# Altium project Board.PrjPCB
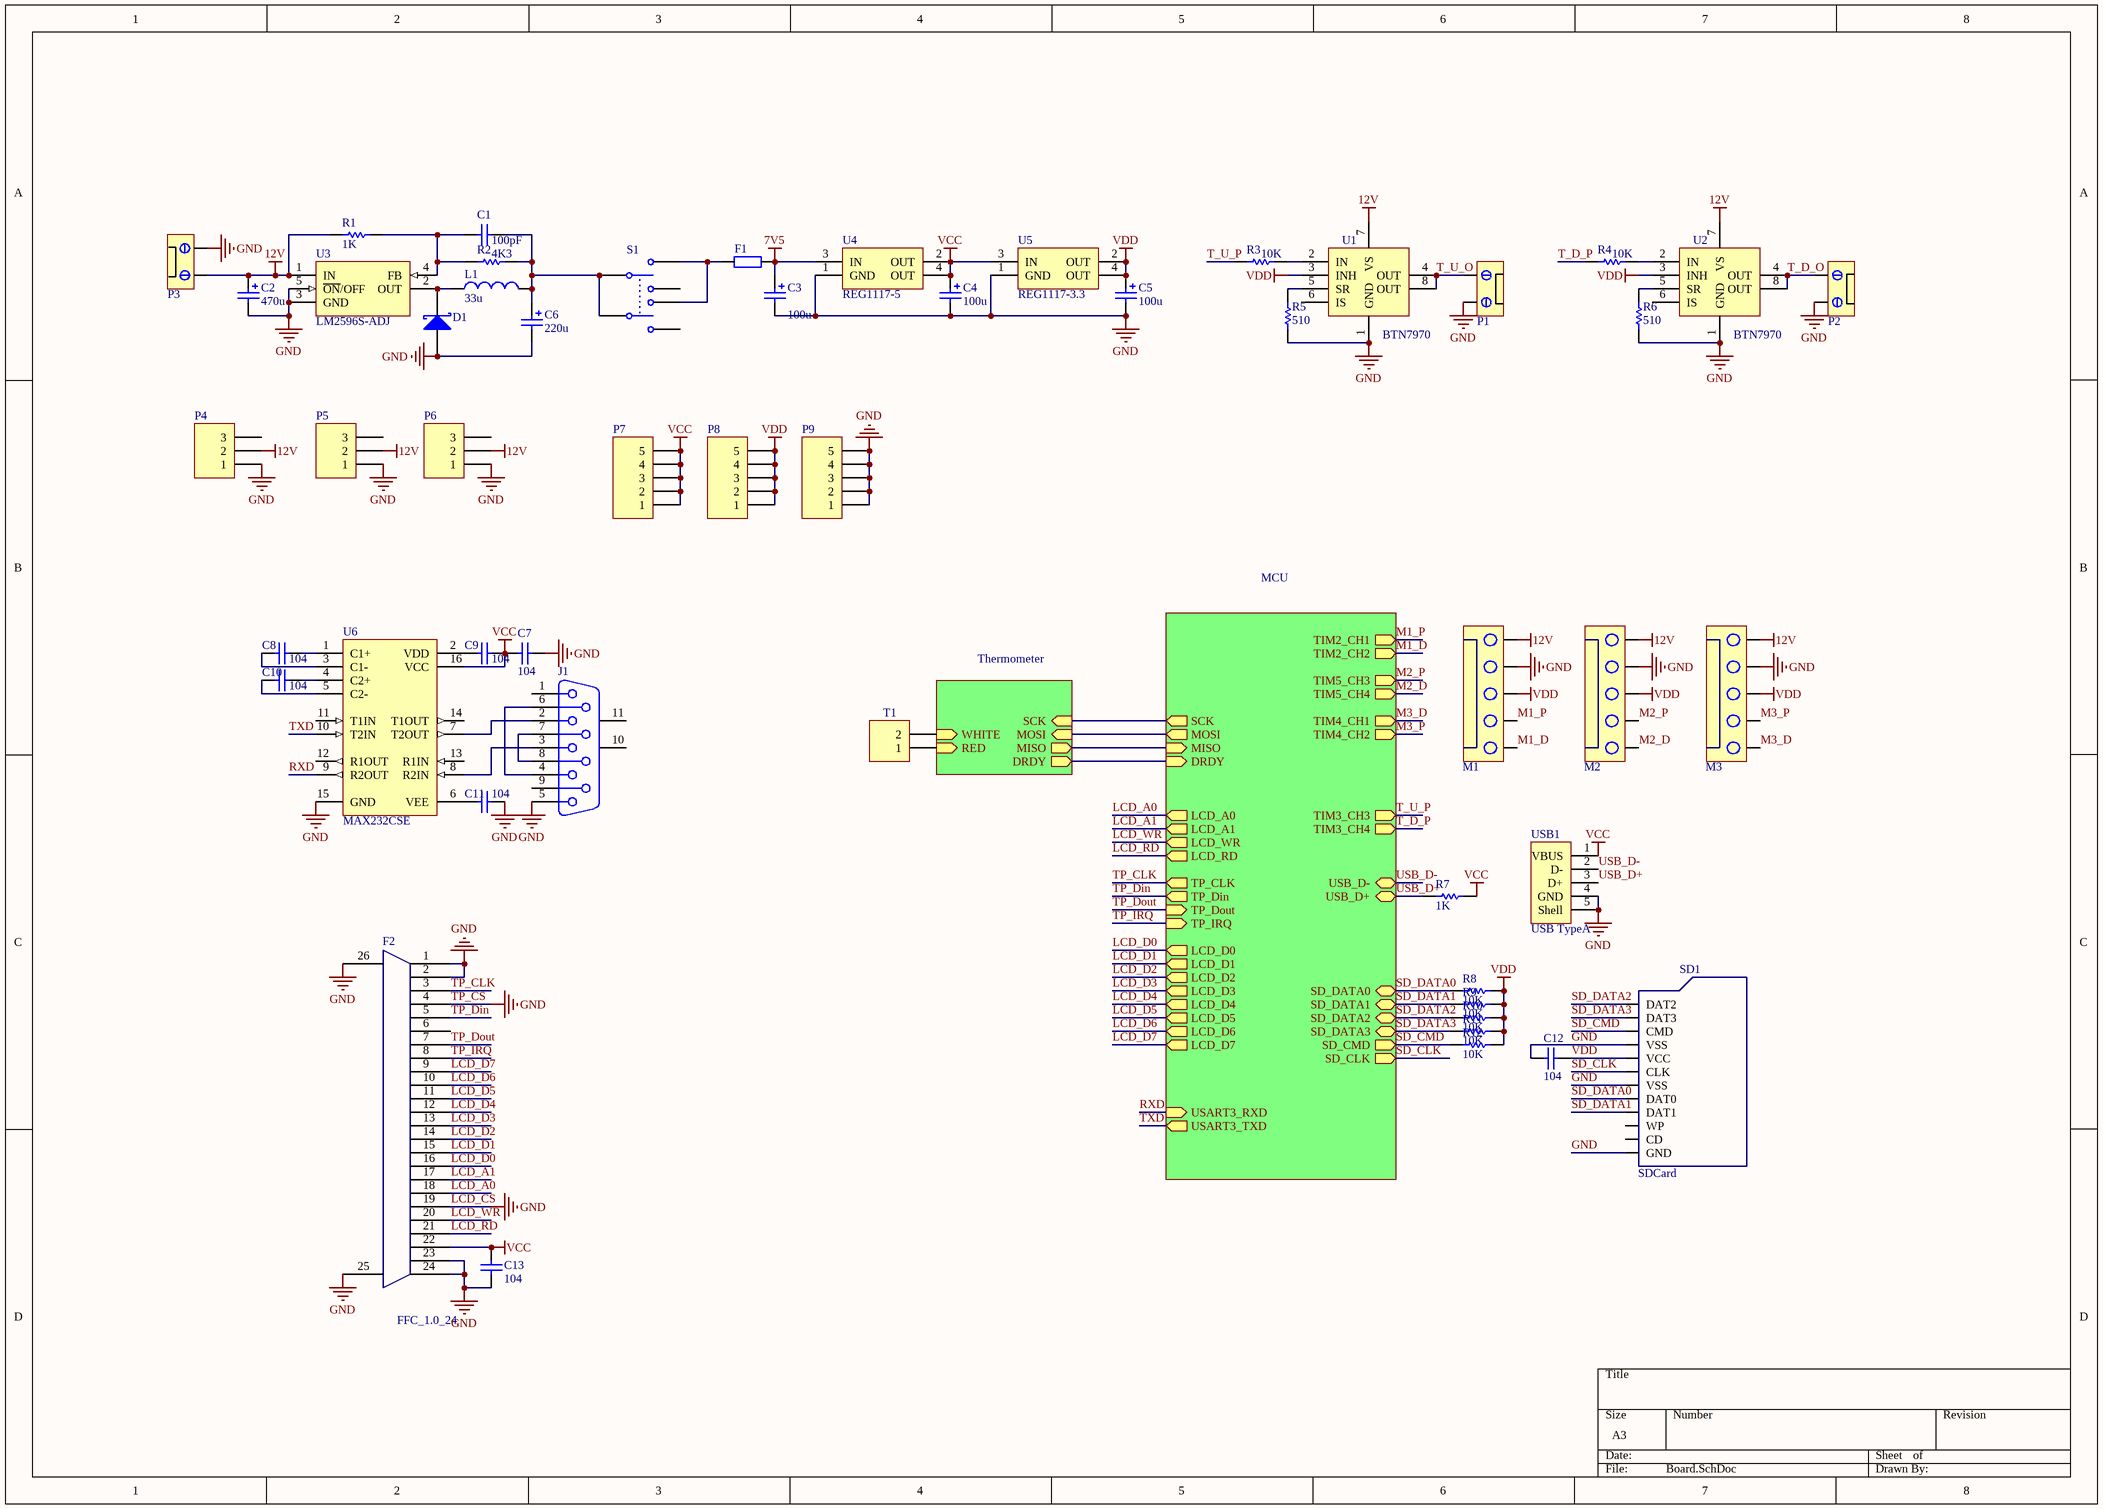
[diagram p0: Board.SchDoc]
3 sheets, 112 parts. Net scope: hierarchical (ports join the sheet entries above them; power ports are global).
Board file: board.PcbDoc
Sheets:
  Board.SchDoc
    Designator = Thermometer.SchDoc
    Designator = MCU.SchDoc

## Sheet Board.SchDoc
size A3

### Parts
C1  value 100pF  [CR2012-0805]  (hidden comment: Cap)
C2  value 470u  [CAP POL Surface MOUNT-10]  (hidden comment: Cap Pol3)
C3  value 100u  [CAP POL Surface Mount-6.3]  (hidden comment: Cap Pol3)
C4  value 100u  [CAP POL Surface Mount-6.3]  (hidden comment: Cap Pol3)
C5  value 100u  [CAP POL Surface Mount-6.3]  (hidden comment: Cap Pol3)
C6  value 220u  [CAP POL Surface Mount-6.3]  (hidden comment: Cap Pol3)
C7  value 104  [CR2012-0805]  (hidden comment: Cap)
C8  value 104  [CR2012-0805]  (hidden comment: Cap)
C9  value 104  [CR2012-0805]  (hidden comment: Cap)
C10  value 104  [CR2012-0805]  (hidden comment: Cap)
C11  value 104  [CR2012-0805]  (hidden comment: Cap)
C12  value 104  [CR2012-0805]  (hidden comment: Cap)
C13  value 104  [CR2012-0805]  (hidden comment: Cap)
D1  D Schottky  [DSO-C2/X2.3]  (value not drawn)
F1  FB  [CR2012-0805]  (value not drawn)
F2  FFC_1.0_24  [FFC/SM1.0-2H24]
J1  D Connector 9  [DSUB1.385-2H9]  (value not drawn)
L1  value 33u  [inductor]  (hidden comment: Inductor)
M1  ConnP_5  [Conn_5-5.08]  (value not drawn)
M2  ConnP_5  [Conn_5-5.08]  (value not drawn)
M3  ConnP_5  [Conn_5-5.08]  (value not drawn)
P1  ConnP_2  [Conn_2-5.08]  (value not drawn)
P2  ConnP_2  [Conn_2-5.08]  (value not drawn)
P3  ConnP_2  [Conn_2-5.08]  (value not drawn)
P4  Header 3  [HDR1X3]  (value not drawn)
P5  Header 3  [HDR1X3]  (value not drawn)
P6  Header 3  [HDR1X3]  (value not drawn)
P7  Header 5  [HDR1X5]  (value not drawn)
P8  Header 5  [HDR1X5]  (value not drawn)
P9  Header 5  [HDR1X5]  (value not drawn)
R1  value 1K  [CR2012-0805]  (hidden comment: Res)
R2  value 4K3  [CR2012-0805]  (hidden comment: Res)
R3  value 10K  [CR2012-0805]  (hidden comment: Res)
R4  value 10K  [CR2012-0805]  (hidden comment: Res)
R5  value 510  [CR2012-0805]  (hidden comment: Res)
R6  value 510  [CR2012-0805]  (hidden comment: Res)
R7  value 1K  [CR2012-0805]  (hidden comment: Res)
R8  value 10K  [CR2012-0805]  (hidden comment: Res)
R9  value 10K  [CR2012-0805]  (hidden comment: Res)
R10  value 10K  [CR2012-0805]  (hidden comment: Res)
R11  value 10K  [CR2012-0805]  (hidden comment: Res)
R12  value 10K  [CR2012-0805]  (hidden comment: Res)
S1  SW-DPDT  [DPDT-6]  (value not drawn)
SD1  SDCard  [SDCARD]
T1  Header 2  [HDR1X2]  (value not drawn)
U1  BTN7970  [TS7B]
U2  BTN7970  [TS7B]
U3  LM2596S-ADJ  [TS5B]
U4  REG1117-5  [ZZ311]
U5  REG1117-3.3  [ZZ311]
U6  MAX232CSE  [NSO16]
USB1  USB TypeA  [USB_A]

### Sub-sheets
Designator = Thermometer: SCK (in), MOSI (in), MISO (out), DRDY (out), WHITE (in), RED (in)
Designator = MCU: USART3_RXD (in), USART3_TXD (out), SCK (out), MOSI (out), MISO (in), DRDY (in), LCD_A0 (out), LCD_A1 (out), LCD_WR (out), LCD_RD (out), TP_CLK (out), TP_Din (out), TP_Dout (in), TP_IRQ (in), LCD_D0 (out), LCD_D1 (out), LCD_D2 (out), LCD_D3 (out), LCD_D4 (out), LCD_D5 (out), LCD_D6 (out), LCD_D7 (out), TIM2_CH1 (out), TIM2_CH2 (out), TIM5_CH3 (out), TIM5_CH4 (out), TIM3_CH3 (out), TIM3_CH4 (out), TIM4_CH1 (out), TIM4_CH2 (out), SD_DATA3 (bidir), SD_DATA0 (bidir), SD_DATA1 (bidir), SD_DATA2 (bidir), SD_CMD (out), SD_CLK (out), USB_D+ (bidir), USB_D- (bidir)

### Nets
7V5: C3.1 F1.2 U4.3(IN)
12V: C2.1 M1.5 M2.5 M3.5 P3.1 P4.2 P5.2 P6.2 R1.1 U1.7(VS) U2.7(VS) U3.1(IN)
GND: C2.2 C3.2 C4.2 C5.2 C6.2 C7.1 C11.1 C12.1 C13.1 D1.1(A) F2.1 F2.2 F2.4 F2.19 F2.23 F2.24 F2.25 F2.26 J1.5 M1.4 M2.4 M3.4 P1.2 P2.2 P3.2 P4.1 P5.1 P6.1 P9.1 P9.2 P9.3 P9.4 P9.5 R5.1 R6.1 SD1.0(GND) SD1.3(VSS) SD1.6(VSS) U1.1(GND) U2.1(GND) U3.3(GND) U3.5(~{ON}/OFF) U4.1(GND) U5.1(GND) U6.15(GND) USB1.4(GND) USB1.5(Shell)  [also labelled LCD_CS, TP_CS]
VCC: C4.1 C7.2 C9.1 C13.2 F2.22 P7.1 P7.2 P7.3 P7.4 P7.5 R7.1 U4.2(OUT) U4.4(OUT) U5.3(IN) U6.16(VCC) USB1.1(VBUS)
VDD: C5.1 C12.2 M1.3 M2.3 M3.3 P8.1 P8.2 P8.3 P8.4 P8.5 R8.2 R9.2 R10.2 R11.2 R12.2 SD1.4(VCC) U1.3(INH) U2.3(INH) U5.2(OUT) U5.4(OUT)
DRDY: sheet Designator/DRDY, sheet Designator/DRDY
LCD_A0: F2.18 ; sheet Designator/LCD_A0
LCD_A1: F2.17 ; sheet Designator/LCD_A1
LCD_D0: F2.16 ; sheet Designator/LCD_D0
LCD_D1: F2.15 ; sheet Designator/LCD_D1
LCD_D2: F2.14 ; sheet Designator/LCD_D2
LCD_D3: F2.13 ; sheet Designator/LCD_D3
LCD_D4: F2.12 ; sheet Designator/LCD_D4
LCD_D5: F2.11 ; sheet Designator/LCD_D5
LCD_D6: F2.10 ; sheet Designator/LCD_D6
LCD_D7: F2.9 ; sheet Designator/LCD_D7
LCD_RD: F2.21 ; sheet Designator/LCD_RD
LCD_WR: F2.20 ; sheet Designator/LCD_WR
M1_D: M1.1 ; sheet Designator/TIM2_CH2
M1_P: M1.2 ; sheet Designator/TIM2_CH1
M2_D: M2.1 ; sheet Designator/TIM5_CH4
M2_P: M2.2 ; sheet Designator/TIM5_CH3
M3_D: M3.1 ; sheet Designator/TIM4_CH1
M3_P: M3.2 ; sheet Designator/TIM4_CH2
MISO: sheet Designator/MISO, sheet Designator/MISO
MOSI: sheet Designator/MOSI, sheet Designator/MOSI
PC13: sheet Designator/SCK, sheet Designator/SCK
RED: T1.1 ; sheet Designator/RED
RXD: U6.9(R2OUT) ; sheet Designator/USART3_RXD  [project net PB11]
SD_CLK: SD1.5(CLK) ; sheet Designator/SD_CLK  [project net PC12]
SD_CMD: R12.1 SD1.2(CMD) ; sheet Designator/SD_CMD  [project net PD2]
SD_DATA0: R8.1 SD1.7(DAT0) ; sheet Designator/SD_DATA0  [project net PC8]
SD_DATA1: R9.1 SD1.8(DAT1) ; sheet Designator/SD_DATA1  [project net PC9]
SD_DATA2: R10.1 SD1.9(DAT2) ; sheet Designator/SD_DATA2  [project net PC10]
SD_DATA3: R11.1 SD1.1(DAT3) ; sheet Designator/SD_DATA3  [project net PC11]
T_D_O: P2.1 U2.4(OUT) U2.8(OUT)
T_D_P: R4.1 ; sheet Designator/TIM3_CH4  [project net PB1]
T_U_O: P1.1 U1.4(OUT) U1.8(OUT)
T_U_P: R3.1 ; sheet Designator/TIM3_CH3  [project net PB0]
TP_CLK: F2.3 ; sheet Designator/TP_CLK  [project net PF10]
TP_Din: F2.5 ; sheet Designator/TP_Din  [project net PF9]
TP_Dout: F2.7 ; sheet Designator/TP_Dout  [project net PF8]
TP_IRQ: F2.8 ; sheet Designator/TP_IRQ  [project net PF7]
TXD: U6.10(T2IN) ; sheet Designator/USART3_TXD  [project net PB10]
USB_D+: R7.2 USB1.3(D+) ; sheet Designator/USB_D+
USB_D-: USB1.2(D-) ; sheet Designator/USB_D-
WHITE: T1.2 ; sheet Designator/WHITE
NetC1_1: C1.1 R1.2 R2.1 U3.4(FB)
NetC1_2: C1.2 C6.1 L1.2 R2.2 S1.2 S1.5
NetC8_1: C8.1 U6.1(C1+)
NetC8_2: C8.2 U6.3(C1-)
NetC9_2: C9.2 U6.2(VDD)
NetC10_1: C10.1 U6.4(C2+)
NetC10_2: C10.2 U6.5(C2-)
NetC11_2: C11.2 U6.6(VEE)
NetD1_2: D1.2(K) L1.1 U3.2(OUT)
NetF1_1: F1.1 S1.1 S1.6
NetJ1_2: J1.2 U6.7(T2OUT)
NetJ1_3: J1.3 U6.8(R2IN)
NetJ1_4: J1.4 J1.6
NetJ1_7: J1.7 J1.8
NetR3_2: R3.2 U1.2(IN)
NetR4_2: R4.2 U2.2(IN)
NetR5_2: R5.2 U1.5(SR)
NetR6_2: R6.2 U2.5(SR)

Not connected (* = marked no-connect by the designer): F2 6(5); J1 1 9 10(MH1) 11(MH2); P4 3; P5 3; P6 3; S1 3 4; SD1 10(WP) 11(CD); U1 6(IS); U2 6(IS); U6 11(T1IN) 12(R1OUT) 13(R1IN) 14(T1OUT)

### Library data of the parts
C1 C7-C13 = Cap: Capacitor; Published: 8-Jun-2000; LatestRevisionDate: 17-Jul-2002; LatestRevisionNote: Re-released for DXP Platform.; Publisher: Altium Limited
C2-C6 = Cap Pol3: Polarized Capacitor (Surface Mount); Published: 8-Jun-2000; LatestRevisionDate: 17-Jul-2002; LatestRevisionNote: Re-released for DXP Platform.; PackageReference: C0805; Publisher: Altium Limited
D1 = D Schottky: Schottky Diode; Published: 8-Jun-2000; LatestRevisionDate: 17-Jul-2002; LatestRevisionNote: Re-released for DXP Platform.; Publisher: Altium Limited; Code_JEDEC: DO-214-AA
F2 = FFC/SM1.0-2H24
J1 = D Connector 9: Receptacle Assembly, 9 Position, Right Angle; PackageDocument: O; Positions: 9; Published: 15-Jun-2001; LatestRevisionDate: 17-Jul-2002; LatestRevisionNote: Re-released for DXP Platform.; DatasheetDocument: 1-Sep-1999; PackageReference: 788750; Publisher: Altium Limited; Orientation: Right Angle; Gender: Receptacle
L1 = Inductor: Code_IEC: 1005; Published: 8-Jun-2000; LatestRevisionDate: 17-Jul-2002; LatestRevisionNote: Re-released for DXP Platform.; PackageReference: 0402-A; Publisher: Altium Limited; Code_JEITA: 0402
P4-P6 = Header 3: Header, 3-Pin; LatestRevisionDate: 17-Jul-2002; LatestRevisionNote: Re-released for DXP Platform.; Publisher: Altium Limited
P7-P9 = Header 5: Header, 5-Pin; LatestRevisionDate: 17-Jul-2002; LatestRevisionNote: Re-released for DXP Platform.; Publisher: Altium Limited
R1-R12 = Res: Resistor; Published: 8-Jun-2000; LatestRevisionDate: 17-Jul-2002; LatestRevisionNote: Re-released for DXP Platform.; Publisher: Altium Limited
S1 = SW-DPDT: Double-Pole, Double-Throw Switch; Published: 24-Mar-1999; LatestRevisionDate: 17-Jul-2002; LatestRevisionNote: Re-released for DXP Platform.; Publisher: Altium Limited
T1 = Header 2: Header, 2-Pin; LatestRevisionDate: 17-Jul-2002; LatestRevisionNote: Re-released for DXP Platform.; Publisher: Altium Limited
U3 = LM2596S-ADJ: Simple Switcher Power Converter 150 kHz 3A Step Down Voltage Regulator; Note: Tab is connected to GND; Published: 15-Apr-2002; DatasheetDocument: Dec-1997; PackageReference: TS5B; Publisher: Altium Limited
U4 = REG1117-5: 800mA and 1A Low Dropout Positive Regulator 2.85V, 3.3V, 5V, and Adjustable; PackageDocument: revC; Published: 8-Jun-2000; LatestRevisionDate: 17-Jul-2002; LatestRevisionNote: Re-released for DXP Platform.; DatasheetDocument: Sep-1997; PackageReference: ZZ311; Publisher: Altium Limited
U5 = REG1117-3.3: 800mA and 1A Low Dropout Positive Regulator 2.85V, 3.3V, 5V, and Adjustable; PackageDocument: revC; Published: 8-Jun-2000; LatestRevisionDate: 17-Jul-2002; LatestRevisionNote: Re-released for DXP Platform.; DatasheetDocument: Sep-1997; PackageReference: ZZ311; Publisher: Altium Limited
U6 = MAX232CSE: +5V Powered, Multi-Channel RS-232 Driver/Receiver; Published: 16-Jan-2001; LatestRevisionDate: 17-Jul-2002; LatestRevisionNote: Re-released for DXP Platform.; PackageReference: NSO16; Publisher: Altium Limited; Code_JEDEC: MS-012-AC; Code_IPC: SO16
USB1 = USB_A

## Sheet Thermometer.SchDoc
size A4
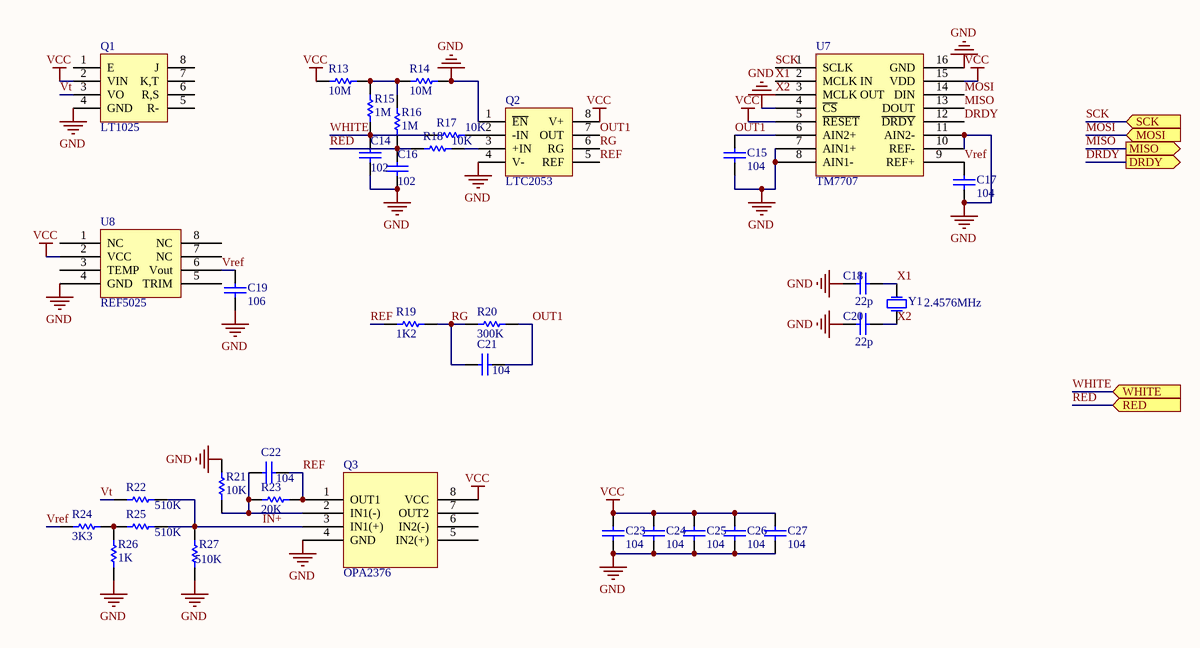
[diagram p1: Thermometer.SchDoc]

### Parts
C14  value 102  [CR2012-0805]  (hidden comment: Cap)
C15  value 104  [CR2012-0805]  (hidden comment: Cap)
C16  value 102  [CR2012-0805]  (hidden comment: Cap)
C17  value 104  [CR2012-0805]  (hidden comment: Cap)
C18  value 22p  [CR2012-0805]  (hidden comment: Cap)
C19  value 106  [CC3216-1206]  (hidden comment: Cap)
C20  value 22p  [CR2012-0805]  (hidden comment: Cap)
C21  value 104  [CR2012-0805]  (hidden comment: Cap)
C22  value 104  [CR2012-0805]  (hidden comment: Cap)
C23  value 104  [CR2012-0805]  (hidden comment: Cap)
C24  value 104  [CR2012-0805]  (hidden comment: Cap)
C25  value 104  [CR2012-0805]  (hidden comment: Cap)
C26  value 104  [CR2012-0805]  (hidden comment: Cap)
C27  value 104  [CR2012-0805]  (hidden comment: Cap)
Q1  LT1025  [SO-G8]
Q2  LTC2053  [MSOP-8]
Q3  OPA2376  [SO-G8]
R13  value 10M  [CR2012-0805]  (hidden comment: Res)
R14  value 10M  [CR2012-0805]  (hidden comment: Res)
R15  value 1M  [CR2012-0805]  (hidden comment: Res)
R16  value 1M  [CR2012-0805]  (hidden comment: Res)
R17  value 10K  [CR2012-0805]  (hidden comment: Res)
R18  value 10K  [CR2012-0805]  (hidden comment: Res)
R19  value 1K2  [CR2012-0805]  (hidden comment: Res)
R20  value 300K  [CR2012-0805]  (hidden comment: Res)
R21  value 10K  [CR2012-0805]  (hidden comment: Res)
R22  value 510K  [CR2012-0805]  (hidden comment: Res)
R23  value 20K  [CR2012-0805]  (hidden comment: Res)
R24  value 3K3  [CR2012-0805]  (hidden comment: Res)
R25  value 510K  [CR2012-0805]  (hidden comment: Res)
R26  value 1K  [CR2012-0805]  (hidden comment: Res)
R27  value 510K  [CR2012-0805]  (hidden comment: Res)
U7  TM7707  [SO-G16/D10]
U8  REF5025  [SO-G8]
Y1  Frequancy: 2.4576MHz  [XTAL]  (hidden comment: XTAL)

### Ports
DRDY (out), MISO (out), MOSI (in), RED (in), SCK (in), WHITE (in)

### Nets
GND: C14.1 C15.2 C16.1 C17.1 C18.1 C19.1 C20.1 C23.1 C24.1 C25.1 C26.1 C27.1 Q1.4(GND) Q2.1(~{EN}) Q2.4(V-) Q3.4(GND) R14.1 R21.2 R26.1 R27.1 U7.4(~{CS}) U7.7(AIN1+) U7.8(AIN1-) U7.10(REF-) U7.11(AIN2-) U7.16(GND) U8.4(GND)
VCC: C23.2 C24.2 C25.2 C26.2 C27.2 Q1.2(VIN) Q2.8(V+) Q3.8(VCC) R13.2 U7.5(~{RESET}) U7.15(VDD) U8.2(VCC)
DRDY: U7.12(~{DRDY}) ; port DRDY
IN+: Q3.3(IN1(+)) R22.2 R25.2 R27.2
MISO: U7.13(DOUT) ; port MISO
MOSI: U7.14(DIN) ; port MOSI
OUT1: C15.1 C21.1 Q2.7(OUT) R20.2 U7.6(AIN2+)
RED: C16.2 R16.1 R18.1 ; port RED
REF: C22.1 Q2.5(REF) Q3.1(OUT1) R19.1 R23.1
RG: C21.2 Q2.6(RG) R19.2 R20.1
SCK: U7.1(SCLK) ; port SCK  [project net PC13]
Vref: C17.2 C19.2 R24.1 U7.9(REF+) U8.6(Vout)
Vt: Q1.3(VO) R22.1
WHITE: C14.2 R15.1 R17.1 ; port WHITE
X1: C18.2 U7.2(MCLK_IN) Y1.2(OSC2)
X2: C20.2 U7.3(MCLK_OUT) Y1.1(OSC1)
NetC22_2: C22.2 Q3.2(IN1(-)) R21.1 R23.2
NetQ2_2: Q2.2(-IN) R17.2
NetQ2_3: Q2.3(+IN) R18.2
NetR13_1: R13.1 R14.2 R15.2 R16.2
NetR24_2: R24.2 R25.1 R26.2

Not connected (* = marked no-connect by the designer): Q1 1(E) 5(R-) 6(R,S) 7(K,T) 8(J); Q3 5(IN2(+)) 6(IN2(-)) 7(OUT2); U8 1(NC) 3(TEMP) 5(TRIM) 7(NC) 8(NC)

### Library data of the parts
C14-C27 = Cap: Capacitor; Published: 8-Jun-2000; LatestRevisionDate: 17-Jul-2002; LatestRevisionNote: Re-released for DXP Platform.; Publisher: Altium Limited
Q3 = Double_AMP
R13-R27 = Res: Resistor; Published: 8-Jun-2000; LatestRevisionDate: 17-Jul-2002; LatestRevisionNote: Re-released for DXP Platform.; Publisher: Altium Limited
Y1 = XTAL: Crystal Oscillator; Published: 8-Jun-2000; LatestRevisionDate: 17-Jul-2002; LatestRevisionNote: Re-released for DXP Platform.; Publisher: Altium Limited

## Sheet MCU.SchDoc
size A3
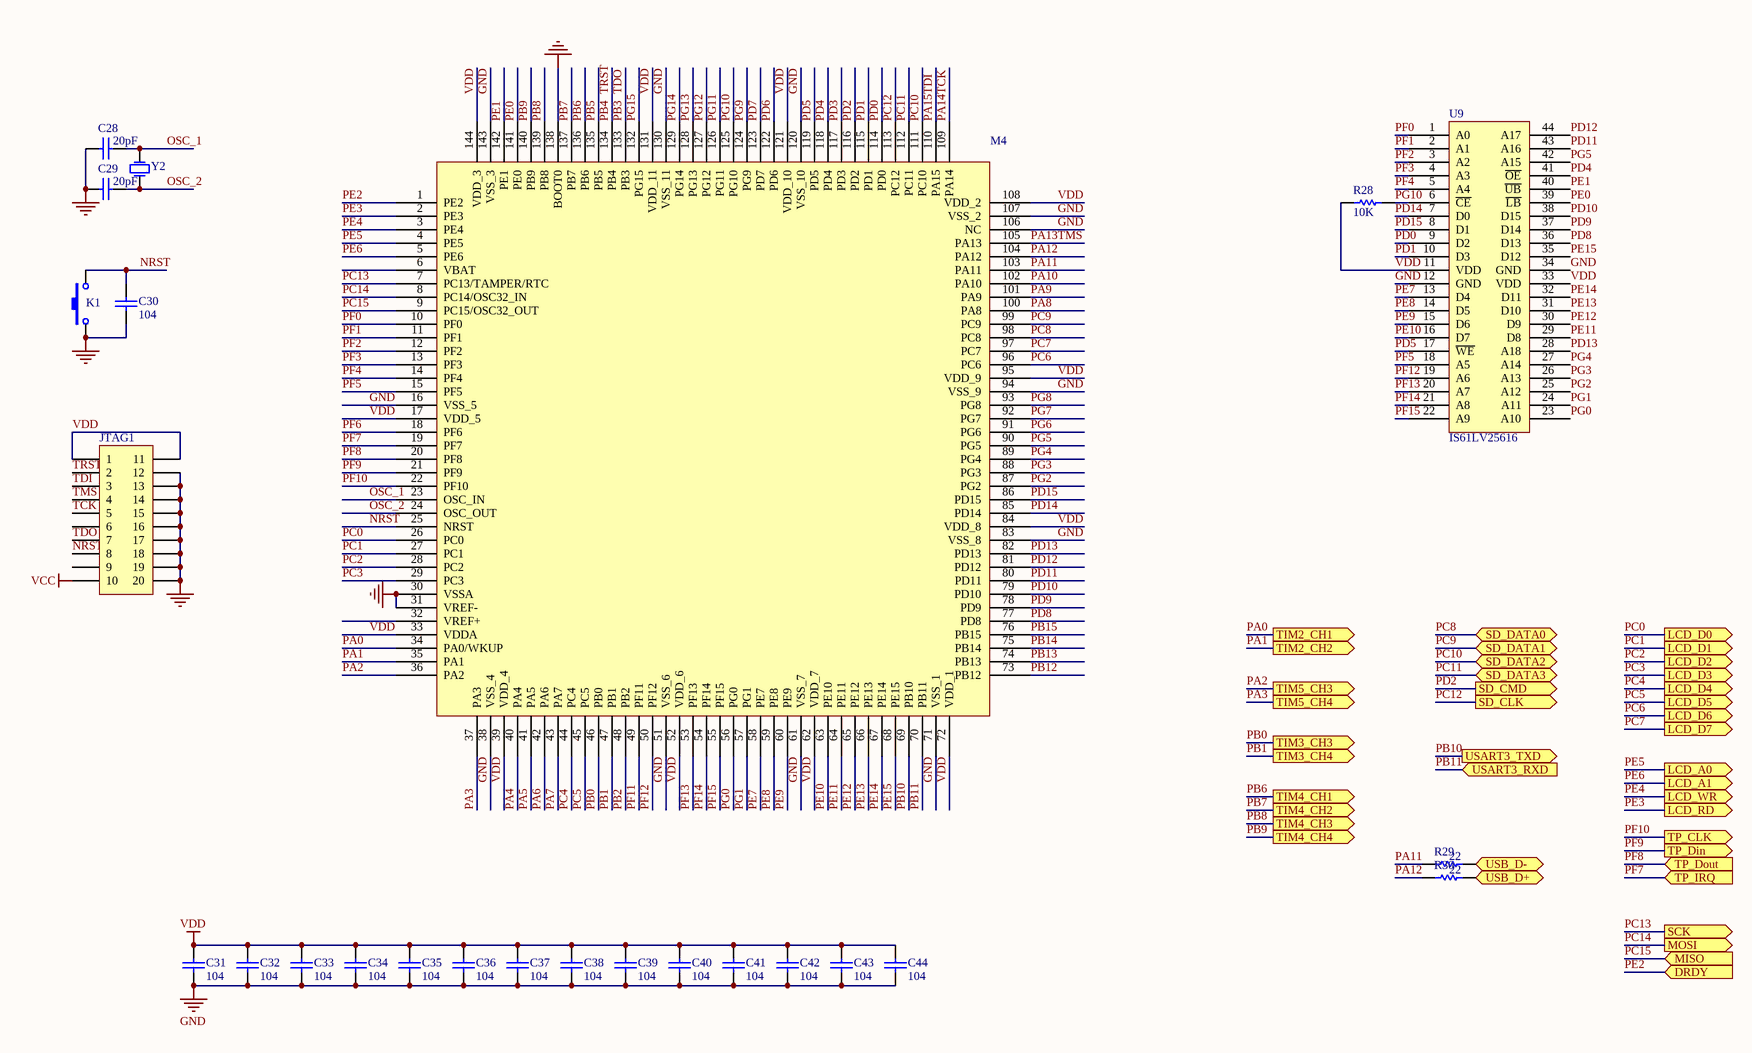
[diagram p2: MCU.SchDoc]

### Parts
C28  value 20pF  [CR2012-0805]  (hidden comment: Cap)
C29  value 20pF  [CR2012-0805]  (hidden comment: Cap)
C30  value 104  [CR2012-0805]  (hidden comment: Cap)
C31  value 104  [CR2012-0805]  (hidden comment: Cap)
C32  value 104  [CR2012-0805]  (hidden comment: Cap)
C33  value 104  [CR2012-0805]  (hidden comment: Cap)
C34  value 104  [CR2012-0805]  (hidden comment: Cap)
C35  value 104  [CR2012-0805]  (hidden comment: Cap)
C36  value 104  [CR2012-0805]  (hidden comment: Cap)
C37  value 104  [CR2012-0805]  (hidden comment: Cap)
C38  value 104  [CR2012-0805]  (hidden comment: Cap)
C39  value 104  [CR2012-0805]  (hidden comment: Cap)
C40  value 104  [CR2012-0805]  (hidden comment: Cap)
C41  value 104  [CR2012-0805]  (hidden comment: Cap)
C42  value 104  [CR2012-0805]  (hidden comment: Cap)
C43  value 104  [CR2012-0805]  (hidden comment: Cap)
C44  value 104  [CR2012-0805]  (hidden comment: Cap)
JTAG1  (no value)  [HDR2X10_CEN]
K1  SW-PB  [SW-PB-6.5x4.5]  (value not drawn)
M4  STM32  [F-QFP20x20-G144/N]  (value not drawn)
R28  value 10K  [CR2012-0805]  (hidden comment: Res)
R29  value 22  [CR2012-0805]  (hidden comment: Res)
R30  value 22  [CR2012-0805]  (hidden comment: Res)
U9  IS61LV25616  [SO-G44/P.8]
Y2  XTAL  [XTAL]  (value not drawn)

### Ports
DRDY (in), LCD_A0 (out), LCD_A1 (out), LCD_D0 (out), LCD_D1 (out), LCD_D2 (out), LCD_D3 (out), LCD_D4 (out), LCD_D5 (out), LCD_D6 (out), LCD_D7 (out), LCD_RD (out), LCD_WR (out), MISO (in), MOSI (out), SCK (out), SD_CLK (out), SD_CMD (out), SD_DATA0 (bidir), SD_DATA1 (bidir), SD_DATA2 (bidir), SD_DATA3 (bidir), TIM2_CH1 (out), TIM2_CH2 (out), TIM3_CH3 (out), TIM3_CH4 (out), TIM4_CH1 (out), TIM4_CH2 (out), TIM4_CH3 (out), TIM4_CH4 (out), TIM5_CH3 (out), TIM5_CH4 (out), TP_CLK (out), TP_Din (out), TP_Dout (in), TP_IRQ (in), USART3_RXD (in), USART3_TXD (out), USB_D+ (bidir), USB_D- (bidir)

### Nets
GND: C28.1 C29.1 C30.1 C31.1 C32.1 C33.1 C34.1 C35.1 C36.1 C37.1 C38.1 C39.1 C40.1 C41.1 C42.1 C43.1 C44.1 JTAG1.12 JTAG1.13 JTAG1.14 JTAG1.15 JTAG1.16 JTAG1.17 JTAG1.18 JTAG1.19 JTAG1.20 K1.1 M4.16(VSS_5) M4.30(VSSA) M4.31(VREF-) M4.38(VSS_4) M4.51(VSS_6) M4.61(VSS_7) M4.71(VSS_1) M4.83(VSS_8) M4.94(VSS_9) M4.106(NC) M4.107(VSS_2) M4.120(VSS_10) M4.130(VSS_11) M4.138(BOOT0) M4.143(VSS_3) U9.12(GND) U9.34(GND)
VCC: JTAG1.10
VDD: C31.2 C32.2 C33.2 C34.2 C35.2 C36.2 C37.2 C38.2 C39.2 C40.2 C41.2 C42.2 C43.2 C44.2 JTAG1.1 JTAG1.11 M4.17(VDD_5) M4.33(VDDA) M4.39(VDD_4) M4.52(VDD_6) M4.62(VDD_7) M4.72(VDD_1) M4.84(VDD_8) M4.95(VDD_9) M4.108(VDD_2) M4.121(VDD_10) M4.131(VDD_11) M4.144(VDD_3) R28.1 U9.11(VDD) U9.33(VDD)
NRST: C30.2 JTAG1.8 K1.2 M4.25(NRST)
OSC_1: C28.2 M4.23(OSC_IN) Y2.2(OSC2)
OSC_2: C29.2 M4.24(OSC_OUT) Y2.1(OSC1)
PA0: M4.34(PA0/WKUP) ; port TIM2_CH1  [project net M1_P]
PA1: M4.35(PA1) ; port TIM2_CH2  [project net M1_D]
PA2: M4.36(PA2) ; port TIM5_CH3  [project net M2_P]
PA3: M4.37(PA3) ; port TIM5_CH4  [project net M2_D]
PA4: M4.40(PA4)
PA5: M4.41(PA5)
PA6: M4.42(PA6)
PA7: M4.43(PA7)
PA8: M4.100(PA8)
PA9: M4.101(PA9)
PA10: M4.102(PA10)
PA11: M4.103(PA11) R29.1
PA12: M4.104(PA12) R30.1
PA13: JTAG1.4 M4.105(PA13)  [also labelled TMS]
PA14: JTAG1.5 M4.109(PA14)  [also labelled TCK]
PA15: JTAG1.3 M4.110(PA15)  [also labelled TDI]
PB0: M4.46(PB0) ; port TIM3_CH3
PB1: M4.47(PB1) ; port TIM3_CH4
PB2: M4.48(PB2)
PB3: JTAG1.7 M4.133(PB3)  [also labelled TDO]
PB4: JTAG1.2 M4.134(PB4)  [also labelled TRST]
PB5: M4.135(PB5)
PB6: M4.136(PB6) ; port TIM4_CH1  [project net M3_D]
PB7: M4.137(PB7) ; port TIM4_CH2  [project net M3_P]
PB8: M4.139(PB8) ; port TIM4_CH3
PB9: M4.140(PB9) ; port TIM4_CH4
PB10: M4.69(PB10) ; port USART3_TXD
PB11: M4.70(PB11) ; port USART3_RXD
PB12: M4.73(PB12)
PB13: M4.74(PB13)
PB14: M4.75(PB14)
PB15: M4.76(PB15)
PC0: M4.26(PC0) ; port LCD_D0  [project net LCD_D0]
PC1: M4.27(PC1) ; port LCD_D1  [project net LCD_D1]
PC2: M4.28(PC2) ; port LCD_D2  [project net LCD_D2]
PC3: M4.29(PC3) ; port LCD_D3  [project net LCD_D3]
PC4: M4.44(PC4) ; port LCD_D4  [project net LCD_D4]
PC5: M4.45(PC5) ; port LCD_D5  [project net LCD_D5]
PC6: M4.96(PC6) ; port LCD_D6  [project net LCD_D6]
PC7: M4.97(PC7) ; port LCD_D7  [project net LCD_D7]
PC8: M4.98(PC8) ; port SD_DATA0
PC9: M4.99(PC9) ; port SD_DATA1
PC10: M4.111(PC10) ; port SD_DATA2
PC11: M4.112(PC11) ; port SD_DATA3
PC12: M4.113(PC12) ; port SD_CLK
PC13: M4.7(PC13/TAMPER/RTC) ; port SCK
PC14: M4.8(PC14/OSC32_IN) ; port MOSI  [project net MOSI]
PC15: M4.9(PC15/OSC32_OUT) ; port MISO  [project net MISO]
PD0: M4.114(PD0) U9.9(D2)
PD1: M4.115(PD1) U9.10(D3)
PD2: M4.116(PD2) ; port SD_CMD
PD3: M4.117(PD3)
PD4: M4.118(PD4) U9.41(~{OE})
PD5: M4.119(PD5) U9.17(~{WE})
PD6: M4.122(PD6)
PD7: M4.123(PD7)
PD8: M4.77(PD8) U9.36(D13)
PD9: M4.78(PD9) U9.37(D14)
PD10: M4.79(PD10) U9.38(D15)
PD11: M4.80(PD11) U9.43(A16)
PD12: M4.81(PD12) U9.44(A17)
PD13: M4.82(PD13) U9.28(A18)
PD14: M4.85(PD14) U9.7(D0)
PD15: M4.86(PD15) U9.8(D1)
PE0: M4.141(PE0) U9.39(~{LB})
PE1: M4.142(PE1) U9.40(~{UB})
PE2: M4.1(PE2) ; port DRDY  [project net DRDY]
PE3: M4.2(PE3) ; port LCD_RD  [project net LCD_RD]
PE4: M4.3(PE4) ; port LCD_WR  [project net LCD_WR]
PE5: M4.4(PE5) ; port LCD_A0  [project net LCD_A0]
PE6: M4.5(PE6) ; port LCD_A1  [project net LCD_A1]
PE7: M4.58(PE7) U9.13(D4)
PE8: M4.59(PE8) U9.14(D5)
PE9: M4.60(PE9) U9.15(D6)
PE10: M4.63(PE10) U9.16(D7)
PE11: M4.64(PE11) U9.29(D8)
PE12: M4.65(PE12) U9.30(D9)
PE13: M4.66(PE13) U9.31(D10)
PE14: M4.67(PE14) U9.32(D11)
PE15: M4.68(PE15) U9.35(D12)
PF0: M4.10(PF0) U9.1(A0)
PF1: M4.11(PF1) U9.2(A1)
PF2: M4.12(PF2) U9.3(A2)
PF3: M4.13(PF3) U9.4(A3)
PF4: M4.14(PF4) U9.5(A4)
PF5: M4.15(PF5) U9.18(A5)
PF6: M4.18(PF6)
PF7: M4.19(PF7) ; port TP_IRQ
PF8: M4.20(PF8) ; port TP_Dout
PF9: M4.21(PF9) ; port TP_Din
PF10: M4.22(PF10) ; port TP_CLK
PF11: M4.49(PF11)
PF12: M4.50(PF12) U9.19(A6)
PF13: M4.53(PF13) U9.20(A7)
PF14: M4.54(PF14) U9.21(A8)
PF15: M4.55(PF15) U9.22(A9)
PG0: M4.56(PG0) U9.23(A10)
PG1: M4.57(PG1) U9.24(A11)
PG2: M4.87(PG2) U9.25(A12)
PG3: M4.88(PG3) U9.26(A13)
PG4: M4.89(PG4) U9.27(A14)
PG5: M4.90(PG5) U9.42(A15)
PG6: M4.91(PG6)
PG7: M4.92(PG7)
PG8: M4.93(PG8)
PG9: M4.124(PG9)
PG10: M4.125(PG10) R28.2 U9.6(~{CE})
PG11: M4.126(PG11)
PG12: M4.127(PG12)
PG13: M4.128(PG13)
PG14: M4.129(PG14)
PG15: M4.132(PG15)
USB_D+: R30.2 ; port USB_D+
USB_D-: R29.2 ; port USB_D-

Not connected (* = marked no-connect by the designer): JTAG1 6 9; M4 6(VBAT) 32(VREF+)

### Library data of the parts
C28-C44 = Cap: Capacitor; Published: 8-Jun-2000; LatestRevisionDate: 17-Jul-2002; LatestRevisionNote: Re-released for DXP Platform.; Publisher: Altium Limited
JTAG1 = Header 10X2A: Header, 10-Pin, Dual row; LatestRevisionDate: 17-Jul-2002; LatestRevisionNote: Re-released for DXP Platform.; Publisher: Altium Limited
K1 = SW-PB: Switch; Published: 24-Mar-1999; LatestRevisionDate: 17-Jul-2002; LatestRevisionNote: Re-released for DXP Platform.; Publisher: Altium Limited
M4 = STM32_104
R28-R30 = Res: Resistor; Published: 8-Jun-2000; LatestRevisionDate: 17-Jul-2002; LatestRevisionNote: Re-released for DXP Platform.; Publisher: Altium Limited
U9 = IS61LV25616: 64K*16 SRAM
Y2 = XTAL: Crystal Oscillator; Published: 8-Jun-2000; LatestRevisionDate: 17-Jul-2002; LatestRevisionNote: Re-released for DXP Platform.; Publisher: Altium Limited

## Nets that join several sheets
GND: Board (47 pins), Thermometer (27 pins), MCU (44 pins)
VCC: Board (16 pins), Thermometer (12 pins), MCU (JTAG1.10)
VDD: Board (20 pins), MCU (31 pins)
DRDY: Thermometer (U7.12), MCU (M4.1)
LCD_A0: Board (F2.18), MCU (M4.4)
LCD_A1: Board (F2.17), MCU (M4.5)
LCD_D0: Board (F2.16), MCU (M4.26)
LCD_D1: Board (F2.15), MCU (M4.27)
LCD_D2: Board (F2.14), MCU (M4.28)
LCD_D3: Board (F2.13), MCU (M4.29)
LCD_D4: Board (F2.12), MCU (M4.44)
LCD_D5: Board (F2.11), MCU (M4.45)
LCD_D6: Board (F2.10), MCU (M4.96)
LCD_D7: Board (F2.9), MCU (M4.97)
LCD_RD: Board (F2.21), MCU (M4.2)
LCD_WR: Board (F2.20), MCU (M4.3)
M1_D: Board (M1.1), MCU (M4.35)
M1_P: Board (M1.2), MCU (M4.34)
M2_D: Board (M2.1), MCU (M4.37)
M2_P: Board (M2.2), MCU (M4.36)
M3_D: Board (M3.1), MCU (M4.136)
M3_P: Board (M3.2), MCU (M4.137)
MISO: Thermometer (U7.13), MCU (M4.9)
MOSI: Thermometer (U7.14), MCU (M4.8)
PB0: Board (R3.1), MCU (M4.46)
PB1: Board (R4.1), MCU (M4.47)
PB10: Board (U6.10), MCU (M4.69)
PB11: Board (U6.9), MCU (M4.70)
PC8: Board (R8.1 SD1.7), MCU (M4.98)
PC9: Board (R9.1 SD1.8), MCU (M4.99)
PC10: Board (R10.1 SD1.9), MCU (M4.111)
PC11: Board (R11.1 SD1.1), MCU (M4.112)
PC12: Board (SD1.5), MCU (M4.113)
PC13: Thermometer (U7.1), MCU (M4.7)
PD2: Board (R12.1 SD1.2), MCU (M4.116)
PF7: Board (F2.8), MCU (M4.19)
PF8: Board (F2.7), MCU (M4.20)
PF9: Board (F2.5), MCU (M4.21)
PF10: Board (F2.3), MCU (M4.22)
RED: Board (T1.1), Thermometer (C16.2 R16.1 R18.1)
USB_D+: Board (R7.2 USB1.3), MCU (R30.2)
USB_D-: Board (USB1.2), MCU (R29.2)
WHITE: Board (T1.2), Thermometer (C14.2 R15.1 R17.1)